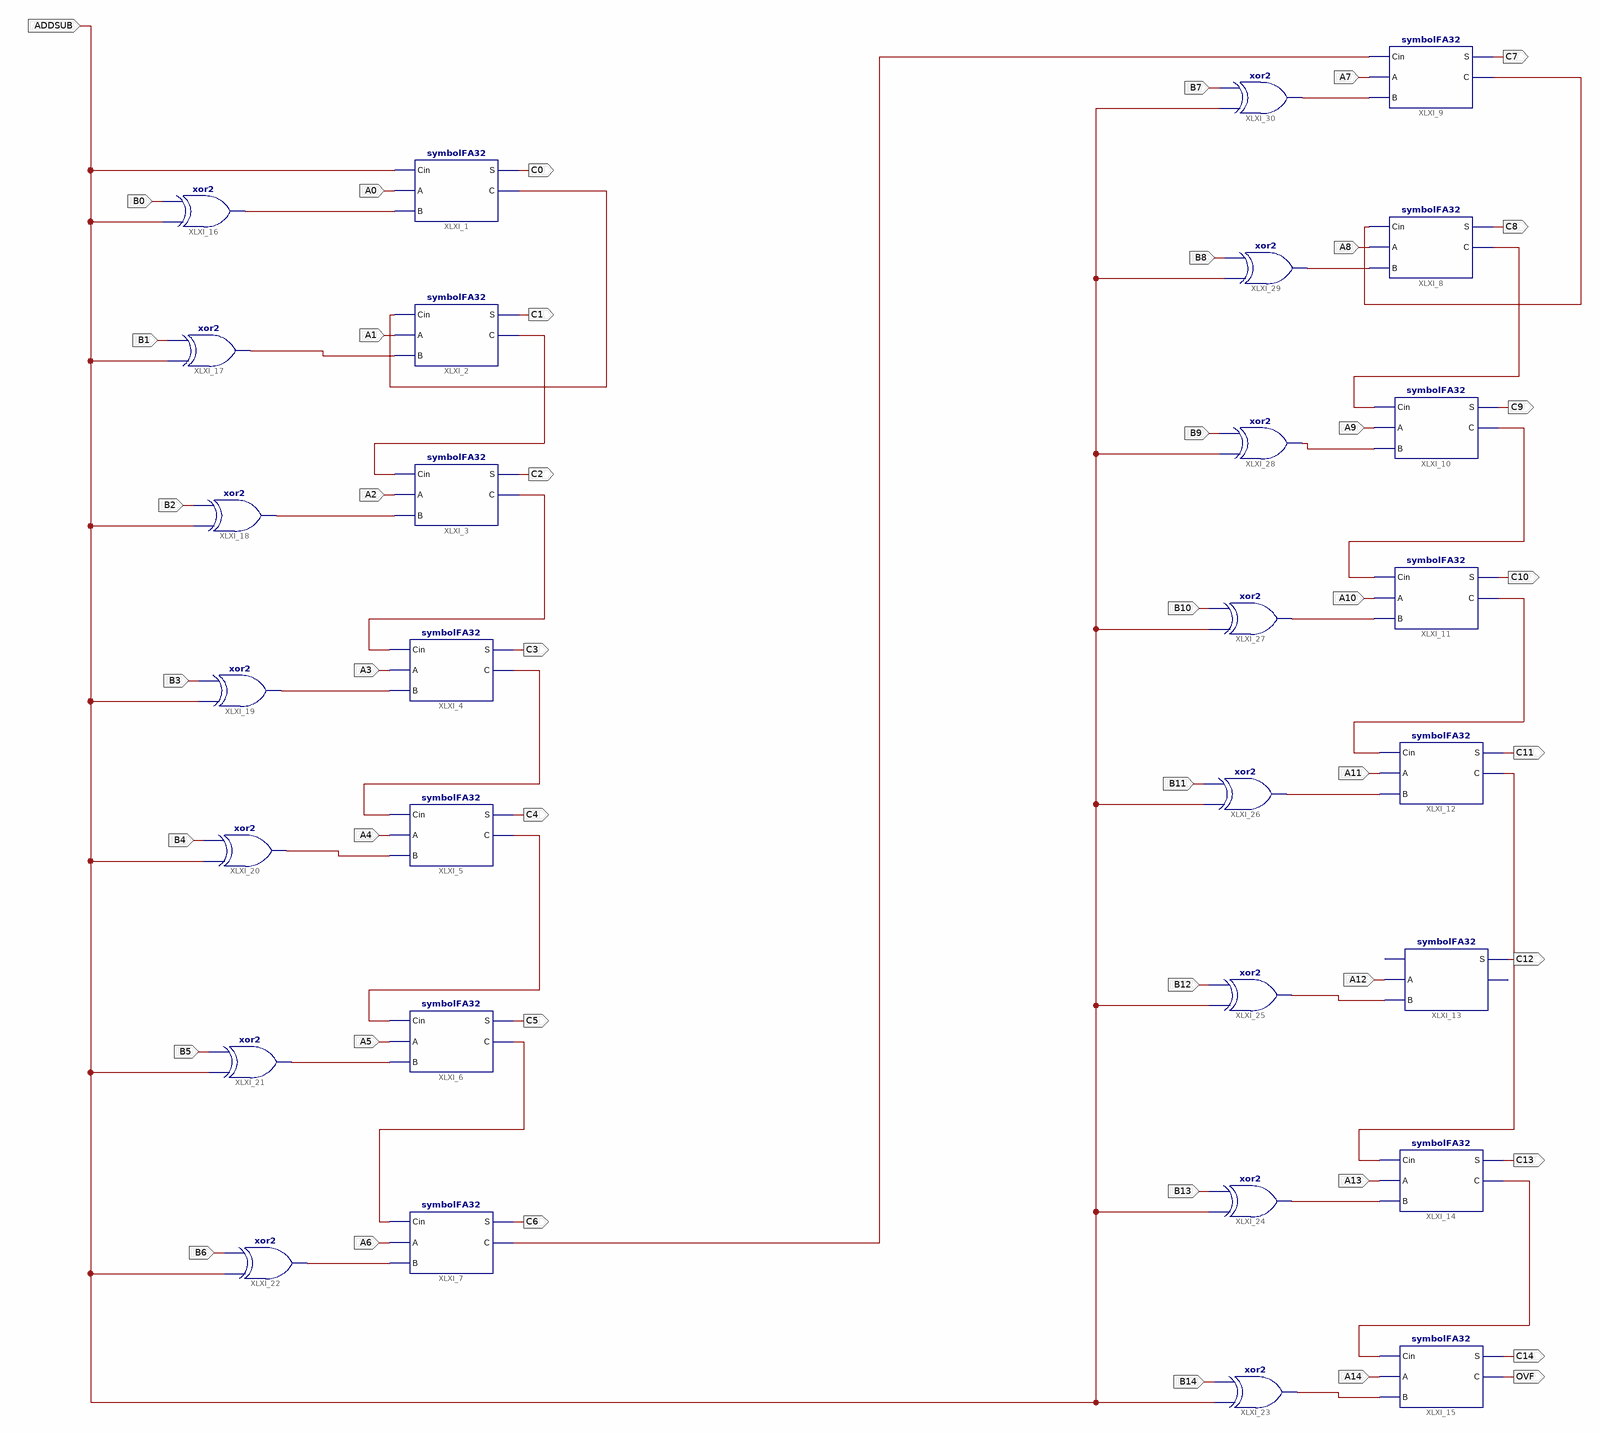
[diagram p0: schematic sheet 1]
// Xilinx ISE schematic lab2soru1genel.sch (spartan3e) as structural Verilog: 30 symbols, 47 ports
module lab2soru1genel (
  input  ADDSUB,
  input  B0,
  input  A0,
  input  A2,
  input  B2,
  input  B3,
  input  A3,
  input  B4,
  input  A4,
  input  B5,
  input  A5,
  input  A6,
  input  B6,
  input  B1,
  input  A1,
  input  B7,
  input  A7,
  input  A8,
  input  B8,
  input  A9,
  input  B9,
  input  A10,
  input  B10,
  input  A11,
  input  B11,
  input  A12,
  input  B12,
  input  A13,
  input  B13,
  input  A14,
  input  B14,
  output C6,
  output C5,
  output C4,
  output C3,
  output C2,
  output C1,
  output C0,
  output C7,
  output C8,
  output C9,
  output C10,
  output C11,
  output C12,
  output C13,
  output C14,
  output OVF
);

  wire XLXN_2, XLXN_3, XLXN_4, XLXN_5, XLXN_6, XLXN_7, XLXN_8, XLXN_9, XLXN_10, XLXN_11, XLXN_12, XLXN_13,
       XLXN_14, XLXN_15, XLXN_16, XLXN_33, XLXN_67, XLXN_70, XLXN_71, XLXN_72, XLXN_73, XLXN_75, XLXN_76,
       XLXN_77, XLXN_78, XLXN_79, XLXN_80, XLXN_81;

  symbolFA32 XLXI_1 (.A(A0), .B(XLXN_2), .C(XLXN_67), .Cin(ADDSUB), .S(C0));
  symbolFA32 XLXI_2 (.A(A1), .B(XLXN_3), .C(XLXN_70), .Cin(XLXN_67), .S(C1));
  symbolFA32 XLXI_3 (.A(A2), .B(XLXN_4), .C(XLXN_71), .Cin(XLXN_70), .S(C2));
  symbolFA32 XLXI_4 (.A(A3), .B(XLXN_5), .C(XLXN_72), .Cin(XLXN_71), .S(C3));
  symbolFA32 XLXI_5 (.A(A4), .B(XLXN_6), .C(XLXN_73), .Cin(XLXN_72), .S(C4));
  symbolFA32 XLXI_6 (.A(A5), .B(XLXN_7), .C(XLXN_33), .Cin(XLXN_73), .S(C5));
  symbolFA32 XLXI_7 (.A(A6), .B(XLXN_8), .C(XLXN_75), .Cin(XLXN_33), .S(C6));
  symbolFA32 XLXI_8 (.A(A8), .B(XLXN_15), .C(XLXN_77), .Cin(XLXN_76), .S(C8));
  symbolFA32 XLXI_9 (.A(A7), .B(XLXN_16), .C(XLXN_76), .Cin(XLXN_75), .S(C7));
  symbolFA32 XLXI_10 (.A(A9), .B(XLXN_14), .C(XLXN_78), .Cin(XLXN_77), .S(C9));
  symbolFA32 XLXI_11 (.A(A10), .B(XLXN_13), .C(XLXN_79), .Cin(XLXN_78), .S(C10));
  symbolFA32 XLXI_12 (.A(A11), .B(XLXN_12), .C(XLXN_80), .Cin(XLXN_79), .S(C11));
  symbolFA32 XLXI_13 (.A(A12), .B(XLXN_11), .S(C12));  // open: C, Cin
  symbolFA32 XLXI_14 (.A(A13), .B(XLXN_10), .C(XLXN_81), .Cin(XLXN_80), .S(C13));
  symbolFA32 XLXI_15 (.A(A14), .B(XLXN_9), .C(OVF), .Cin(XLXN_81), .S(C14));
  xor XLXI_16 (XLXN_2, ADDSUB, B0);
  xor XLXI_17 (XLXN_3, ADDSUB, B1);
  xor XLXI_18 (XLXN_4, ADDSUB, B2);
  xor XLXI_19 (XLXN_5, ADDSUB, B3);
  xor XLXI_20 (XLXN_6, ADDSUB, B4);
  xor XLXI_21 (XLXN_7, ADDSUB, B5);
  xor XLXI_22 (XLXN_8, ADDSUB, B6);
  xor XLXI_23 (XLXN_9, ADDSUB, B14);
  xor XLXI_24 (XLXN_10, ADDSUB, B13);
  xor XLXI_25 (XLXN_11, ADDSUB, B12);
  xor XLXI_26 (XLXN_12, ADDSUB, B11);
  xor XLXI_27 (XLXN_13, ADDSUB, B10);
  xor XLXI_28 (XLXN_14, ADDSUB, B9);
  xor XLXI_29 (XLXN_15, ADDSUB, B8);
  xor XLXI_30 (XLXN_16, ADDSUB, B7);
endmodule
